# EAGLE design graphiclcd (EAGLE 4.16)
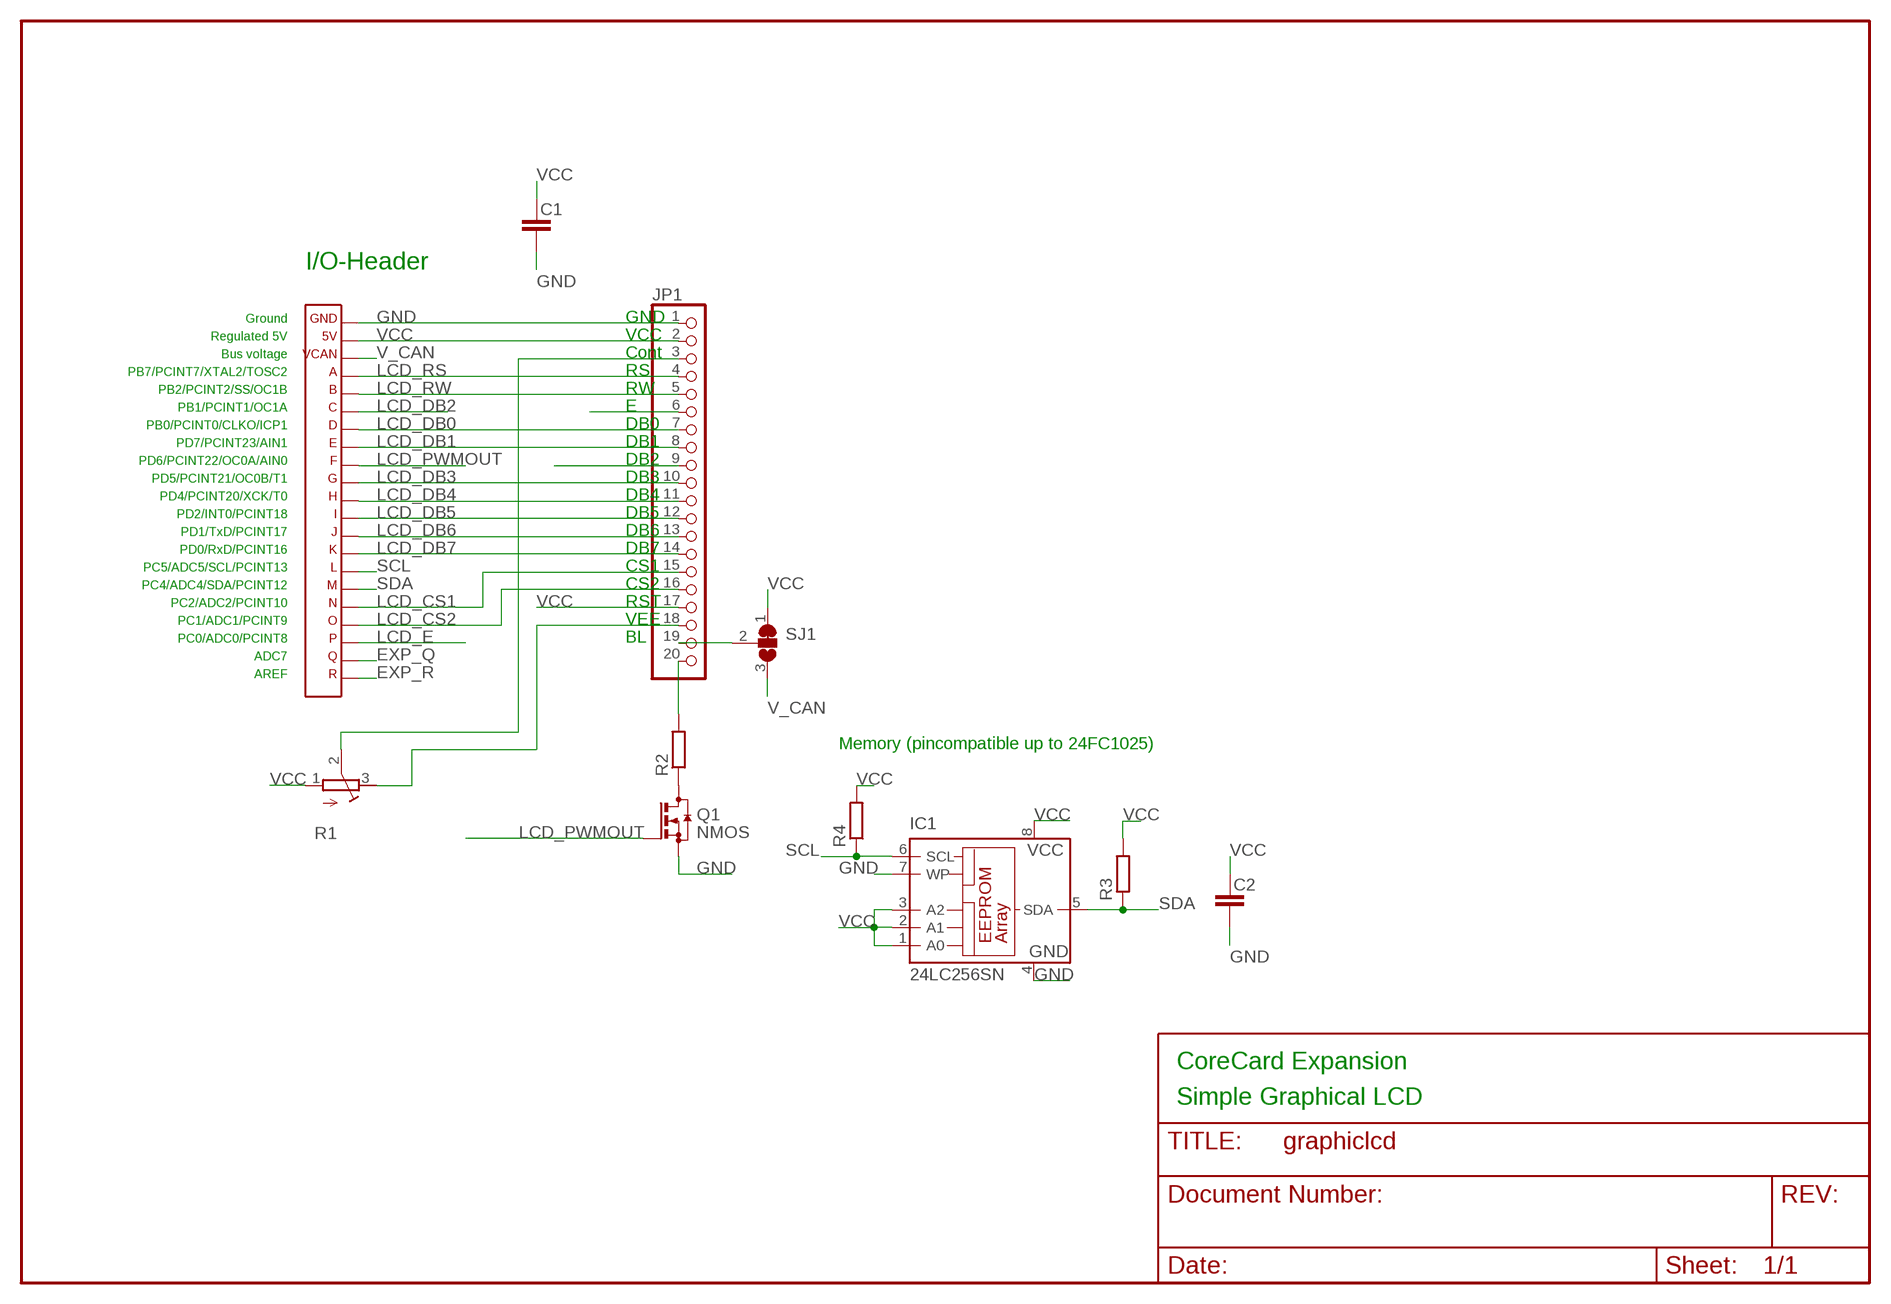
[diagram p0: schematic, sheet 1]

## Parts
C1  C-EUC0603  [C0603]
C2  C-EUC0603  [C0603]
IC1  24LC256SN  [SO-08]
JP1  PINHD-2X10  [2X10]
Q1  NMOS  [SOT23]
R1  R-TRIM  [TRIM_PVZ3]
R2  R-EU_0207/15  [0207/15]
R3  R-EUR0603  [R0603]
R4  R-EUR0603  [R0603]
SJ1  SJ_2_NO_NCSMALL  [SJ_2_NO_NC_SMALL]
X3  CORE_IOHEADEXP  [CORE_IOHEAD_NOSILC]

## Nets
BL_PWR: JP1.19 SJ1.2
EXP_Q: X3.20
EXP_R: X3.21
GND: C1.2 C2.2 IC1.4(GND) IC1.7(WP) JP1.1 Q1.2(S) X3.1
LCD_CONTRAST: JP1.3 R1.2(PAD2)
LCD_CS1: JP1.15 X3.17
LCD_CS2: JP1.16 X3.18
LCD_DB0: JP1.7 X3.7
LCD_DB1: JP1.8 X3.8
LCD_DB2: JP1.9 X3.6
LCD_DB3: JP1.10 X3.10
LCD_DB4: JP1.11 X3.11
LCD_DB5: JP1.12 X3.12
LCD_DB6: JP1.13 X3.13
LCD_DB7: JP1.14 X3.14
LCD_E: JP1.6 X3.19
LCD_PWMOUT: Q1.1(G) X3.9
LCD_RS: JP1.4 X3.4
LCD_RW: JP1.5 X3.5
LCD_VEE: JP1.18 R1.3(PAD3)
N$1: Q1.3(D) R2.1
N$4: JP1.20 R2.2
SCL: IC1.6(SCL) R4.1 X3.15
SDA: IC1.5(SDA) R3.1 X3.16
V_CAN: SJ1.3 X3.3
VCC: C1.1 C2.1 IC1.1(A0) IC1.2(A1) IC1.3(A2) IC1.8(VCC) JP1.2 JP1.17 R1.1(PAD1) R3.2 R4.2 SJ1.1 X3.2

## Notes on the sheet
- I/O-Header
- Ground | GND
- Regulated 5V | VCC
- Bus voltage | Cont
- PB7/PCINT7/XTAL2/TOSC2 | RS
- PB2/PCINT2/SS/OC1B | RW
- PB1/PCINT1/OC1A | E
- PB0/PCINT0/CLKO/ICP1 | DB0
- PD7/PCINT23/AIN1 | DB1
- PD6/PCINT22/OC0A/AIN0 | DB2
- PD5/PCINT21/OC0B/T1 | DB3
- PD4/PCINT20/XCK/T0 | DB4
- PD2/INT0/PCINT18 | DB5
- PD1/TxD/PCINT17 | DB6
- PD0/RxD/PCINT16 | DB7
- PC5/ADC5/SCL/PCINT13 | CS1
- PC4/ADC4/SDA/PCINT12 | CS2
- PC2/ADC2/PCINT10 | RST
- PC1/ADC1/PCINT9 | VEE
- PC0/ADC0/PCINT8 | BL
- ADC7
- AREF
- Memory (pincompatible up to 24FC1025)
- CoreCard Expansion
- Simple Graphical LCD

## Library data of the parts
C1 C2 = rcl:C-EU
IC1 = microchip:24*: Serial EEPROM I2C
JP1 = pinhead-mm:PINHD-2X10
Q1 = transistor:NMOS
R1 = rcl:R-TRIM
R2 = rcl:R-EU_: RESISTOR, European symbol
R3 R4 = rcl:R-EU
SJ1 = jumper:SJ_2_NO_NC
X3 = expboard:CORE_IOHEAD: CoreCard IO-header for expansion cards

## Board
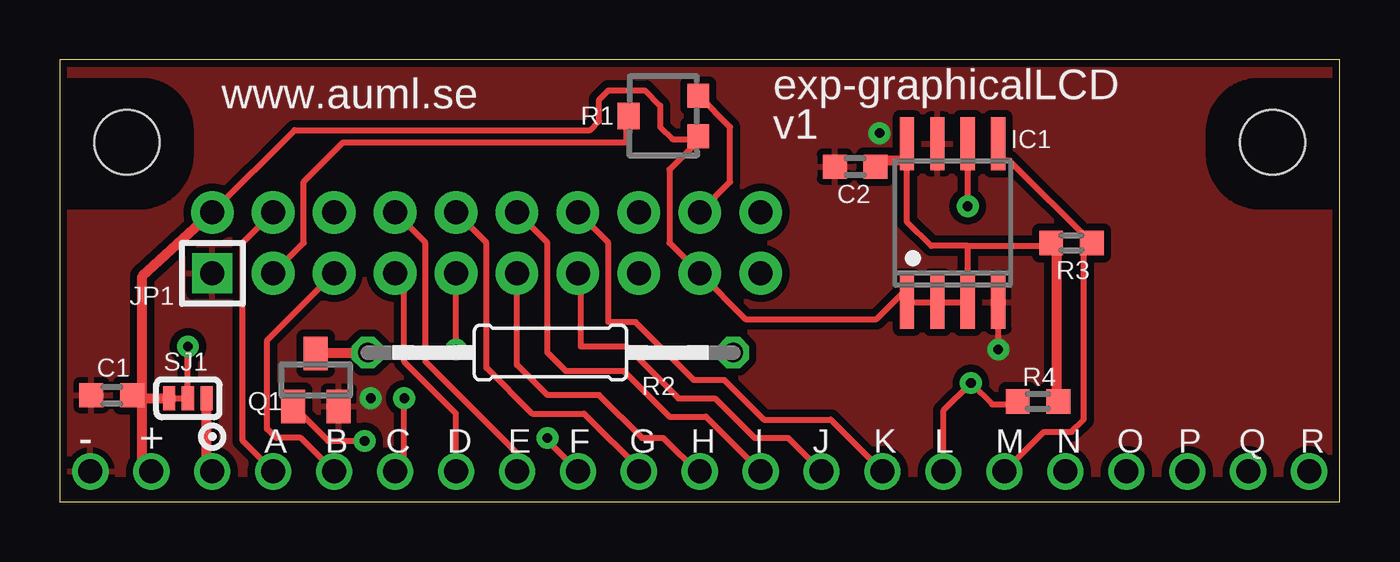
[diagram p1: board, top side]
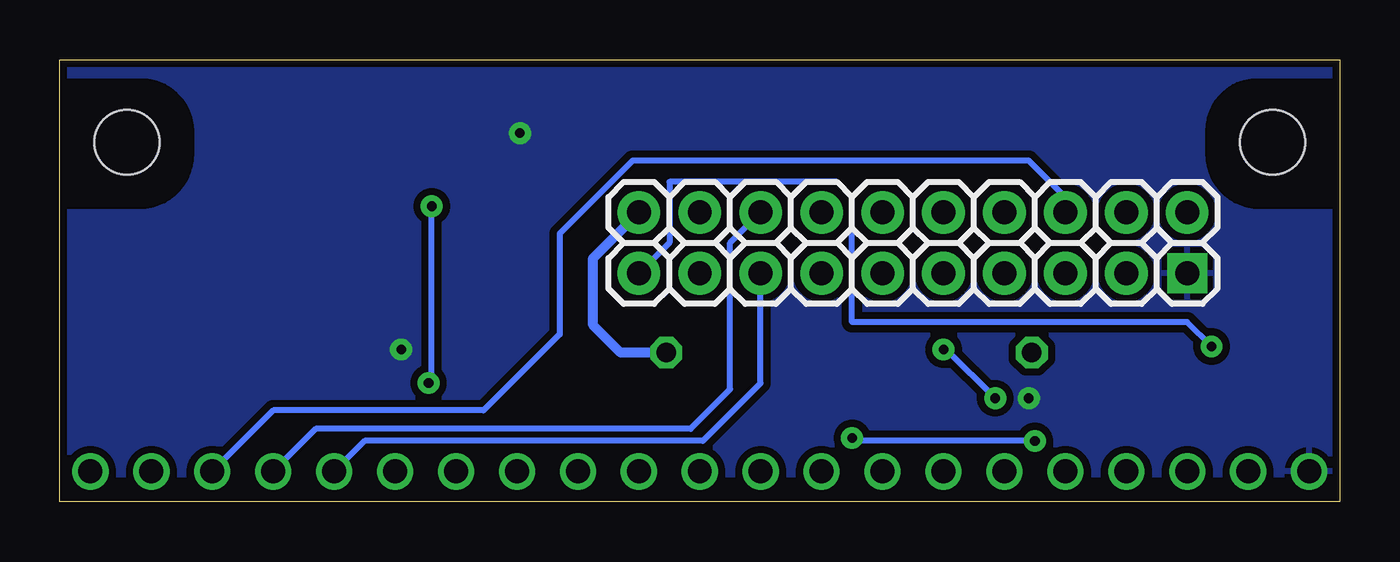
[diagram p2: board, bottom side, seen from below]

Size 53.34 x 18.41 mm. Coordinates in mm from the lower left corner, seen from the top.
Outline: 0,0 53.34,0 53.34,18.41 0,18.41 0,0
Copper layers (1*16): Top 0.035mm / dielectric 1.5mm / Bottom 0.035mm
Design rules "default": minimum track width 10mil, minimum drill 0.4mm, track to track 10mil, track to pad 10mil, pad to pad 10mil, via to via 10mil, smd to smd 8mil, copper to edge 10mil, drill to drill 8mil, minimum pad ring 10mil, minimum via ring 10mil, stop-mask expansion 4mil, vias tented up to drill 0.5mm, thermal gap 10mil
Holes 2.7 mm at 50.55,14.99 2.79,14.99

### Footprints (pad centres in the part's own frame; a part is rotated, then mirrored left to right if it is on the bottom)
C0603 = smd 1 x 1: 1 -0.85,0; 2 0.85,0
SO-08 = smd 0.6 x 2.2: 1 -1.905,-3.362; 2 -0.635,-3.362; 3 0.635,-3.362; 4 1.905,-3.362; 5 1.905,3.235; 6 0.635,3.235; 7 -0.635,3.235; 8 -1.905,3.235
2X10 = drill 1 pad 1.676 square: 1 -10.16,1.27 | drill 1 pad 1.778 round: 2 -10.16,-1.27; 3 -7.62,1.27; 4 -7.62,-1.27; 5 -5.08,1.27; 6 -5.08,-1.27; 7 -2.54,1.27; 8 -2.54,-1.27; 9 0,1.27; 10 0,-1.27; 11 2.54,1.27; 12 2.54,-1.27; 13 5.08,1.27; 14 5.08,-1.27; 15 7.62,1.27; 16 7.62,-1.27; 17 10.16,1.27; 18 10.16,-1.27; 19 12.7,1.27; 20 12.7,-1.27
SOT23 = smd 1 x 1.4: 1 -0.95,-1.1; 2 0.95,-1.1; 3 0,1.1
TRIM_PVZ3 = smd 1 x 0.9: 1 0.5,0.45; 3 2.2,0.45 | smd 1.1 x 0.9: 2 1.35,3.35
0207/15 = drill 0.813 octagon: 1 -7.62,0; 2 7.62,0
R0603 = smd 0.991 x 1.016: 1 -0.85,0; 2 0.85,0
SJ_2_NO_NC_SMALL = smd 0.508 x 1.016: 1 -0.787,0; 2 0,0; 3 0.787,0
CORE_IOHEAD_NOSILC = drill 1 round: 1 25.4,0; 2 22.86,0; 3 20.32,0; 4 17.78,0; 5 15.24,0; 6 12.7,0; 7 10.16,0; 8 7.62,0; 9 5.08,0; 10 2.54,0; 11 0,0; 12 -2.54,0; 13 -5.08,0; 14 -7.62,0; 15 -10.16,0; 16 -12.7,0; 17 -15.24,0; 18 -17.78,0; 19 -20.32,0; 20 -22.86,0; 21 -25.4,0

### Placement (x,y rotation side)
C1  2.16,4.45 180 top
C2  33.15,13.97 180 top
IC1  37.21,11.68 0 top
JP1  16.51,10.79 180 bottom
Q1  10.67,5.08 0 top
R1  27.05,14.73 90 top
R2  20.45,6.22 0 top
R3  42.16,10.79 180 top
R4  40.77,4.19 0 top
SJ1  5.33,4.32 0 top
X3  26.67,1.27 0 bottom

### Tracks (layer width: path | path; a pad name or v marks a point on that pad's centre or on a via)
BL_PWR  (via drill 0.4)
  Top 0.254: SJ1.2 v5.33,6.48
  Bottom 0.254: v5.33,6.48 6.35,7.49 20.32,7.49 20.32,12.7 20.95,13.34 27.94,13.34 27.94,10.79 JP1.19
GND  (via drill 0.4)
  Top 0.254: v39.12,6.35 IC1.4
  other vias: 34.16,15.37 12.95,4.32
  pour Bottom (isolate 0.305, rank 3): 0,18.41 53.34,18.41 53.34,17.78 50.04,17.78 arc90 47.62,15.49 47.62,14.48 arc90 50.04,12.06 53.34,12.06 53.34,1.14 0,1.14 0,12.06 3.3,12.06 arc90 5.71,14.48 5.71,15.49 arc90 3.43,17.78 0,17.78
  pour Top (isolate 0.305, rank 3): 0,18.41 53.34,18.41 53.34,17.78 50.04,17.78 arc90 47.62,15.49 47.62,14.48 arc90 50.04,12.06 53.34,12.06 53.34,1.14 0,1.14 0,12.06 3.3,12.06 arc90 5.71,14.48 5.71,15.49 arc90 3.43,17.78 0,17.78
LCD_CONTRAST
  Top 0.254: R1.2 23.7,16.05 23.75,16 23.62,15.87 23.62,14.99 11.81,14.99 10.16,13.34 10.16,10.79 JP1.3
LCD_CS1
  Bottom 0.254: X3.17 40.64,2.54 26.54,2.54 24.13,4.95 JP1.15
LCD_CS2
  Bottom 0.254: X3.18 42.67,3.05 27.05,3.05 25.4,4.7 25.4,10.79 JP1.16
LCD_DB0
  Top 0.254: X3.7 16.51,3.68 14.35,5.84 14.35,9.14 JP1.7
LCD_DB1
  Top 0.254: JP1.8 15.24,10.79 15.24,5.84 19.05,2.03 X3.8 19.05,1.14
LCD_DB2  (via drill 0.4)
  Top 0.254: v16.51,6.35 JP1.9 | X3.6 13.97,1.14 14.35,1.52 v14.35,4.32
  Bottom 0.254: v16.51,6.35 16.38,6.35 v14.35,4.32
LCD_DB3
  Top 0.254: JP1.10 17.78,10.79 17.78,5.59 19.68,3.68 21.84,3.68 24.26,1.27 X3.10
LCD_DB4
  Top 0.254: JP1.11 19.05,5.71 20.32,4.45 22.48,4.45 24.26,2.67 25.15,2.67 26.67,1.14 X3.11
LCD_DB5
  Top 0.254: JP1.12 20.32,10.79 20.32,6.22 21.08,5.46 23.5,5.46 25.4,3.56 26.92,3.56 X3.12
LCD_DB6
  Top 0.254: JP1.13 21.72,9.4 21.72,6.48 23.62,6.48 25.78,4.32 27.3,4.32 28.96,2.67 30.35,2.67 X3.13
LCD_DB7
  Top 0.254: JP1.14 22.86,10.79 22.86,7.49 24,7.49 26.42,5.08 27.69,5.08 29.34,3.43 32.13,3.43 X3.14 34.42,1.14
LCD_E
  Bottom 0.254: JP1.6 11.43,12.7 12.95,14.22 29.46,14.22 32.51,11.18 32.51,6.99 35.69,3.81 44.45,3.81 X3.19
LCD_PWMOUT  (via drill 0.4)
  Top 0.254: 21.72,1.14 X3.9 20.32,2.54 v20.32,2.67 | Q1.1 9.74,3.98 11.18,2.54 v12.7,2.54
  Bottom 0.254: X3.9 21.72,1.14 | v12.7,2.54 20.19,2.54 v20.32,2.67
LCD_RS
  Top 0.254: 8.89,1.14 X3.4 7.62,2.54 7.62,10.79 JP1.4
LCD_RW
  Top 0.254: X3.5 10.03,2.67 9.02,2.67 8.64,3.05 8.64,6.73 JP1.5
LCD_VEE
  Top 0.254: R1.3 26.63,16.93 27.94,15.62 27.94,13.34 JP1.18
N$1
  Top 0.406: 10.62,6.22 10.54,6.22 | Q1.3 10.62,6.22 | 10.62,6.22 R2.1
N$4
  Bottom 0.406: JP1.20 31.11,10.16 31.11,7.37 29.97,6.22 R2.2
SCL  (via drill 0.4)
  Top 0.254: v37.85,12.32 IC1.6 | R4.1 39.62,4.06 38.86,4.06 v37.97,4.95 36.83,3.81 X3.15
  Bottom 0.254: v37.85,12.32 37.85,5.08 v37.97,4.95
SDA
  Top 0.254: 39.12,14.22 39.59,14.22 R3.1 42.67,10.79 42.67,3.43 42.16,2.92 41.02,2.92 X3.16
  Top 0.406: 39.12,14.22 IC1.5
V_CAN
  Top 0.406: SJ1.3 6.12,1.42 X3.3
VCC
  Top 0.254: IC1.1 IC1.2 IC1.3 37.85,10.67 | 35.31,8.89 34.04,7.62 28.57,7.62 JP1.17 25.4,10.79 25.4,13.84 26.67,15.11 26.6,15.18 R1.1 26.6,15.17 26.54,15.11 25.53,15.11 25.02,15.62 25.02,16.51 24.38,17.14 22.86,17.14 22.48,16.76 22.48,15.88 22.1,15.49 9.78,15.49 JP1.2 | 37.85,10.67 41.15,10.67 | 37.85,10.67 36.32,10.67 35.31,11.68 35.31,14.22
  Top 0.406: X3.2 3.43,1.65 3.43,4.32 | R3.2 41.4,10.79 | IC1.2 36.58,9.14 | 35.31,9.14 IC1.1 35.31,8.89 | 41.15,10.67 R3.2 | R3.2 41.44,10.67 41.53,10.67 41.53,4.41 R4.2 | JP1.2 3.43,9.4 3.43,4.45 | IC1.8 35.31,14.22 34.25,14.22 C2.1 | 3.43,4.45 C1.1 | 3.43,4.32 3.43,4.45 | 3.43,4.32 SJ1.1

### Text on the board
tPlace: exp-graphicalLCD | www.auml.se | v1 | - | + | A | B | C | D | E | F | G | H | I | J | K | L | M | N | O | P | Q | R
Document: Top is component side | Expansion will be mounted bottom to bottom with CoreCard | Change vertical dimension to fit | Remove I/O-header silcscreen if neccesary | Remove mounting holes if neccesary